# Altium schematic sheet PAGE12.SchDoc
size 246 x 182 mm
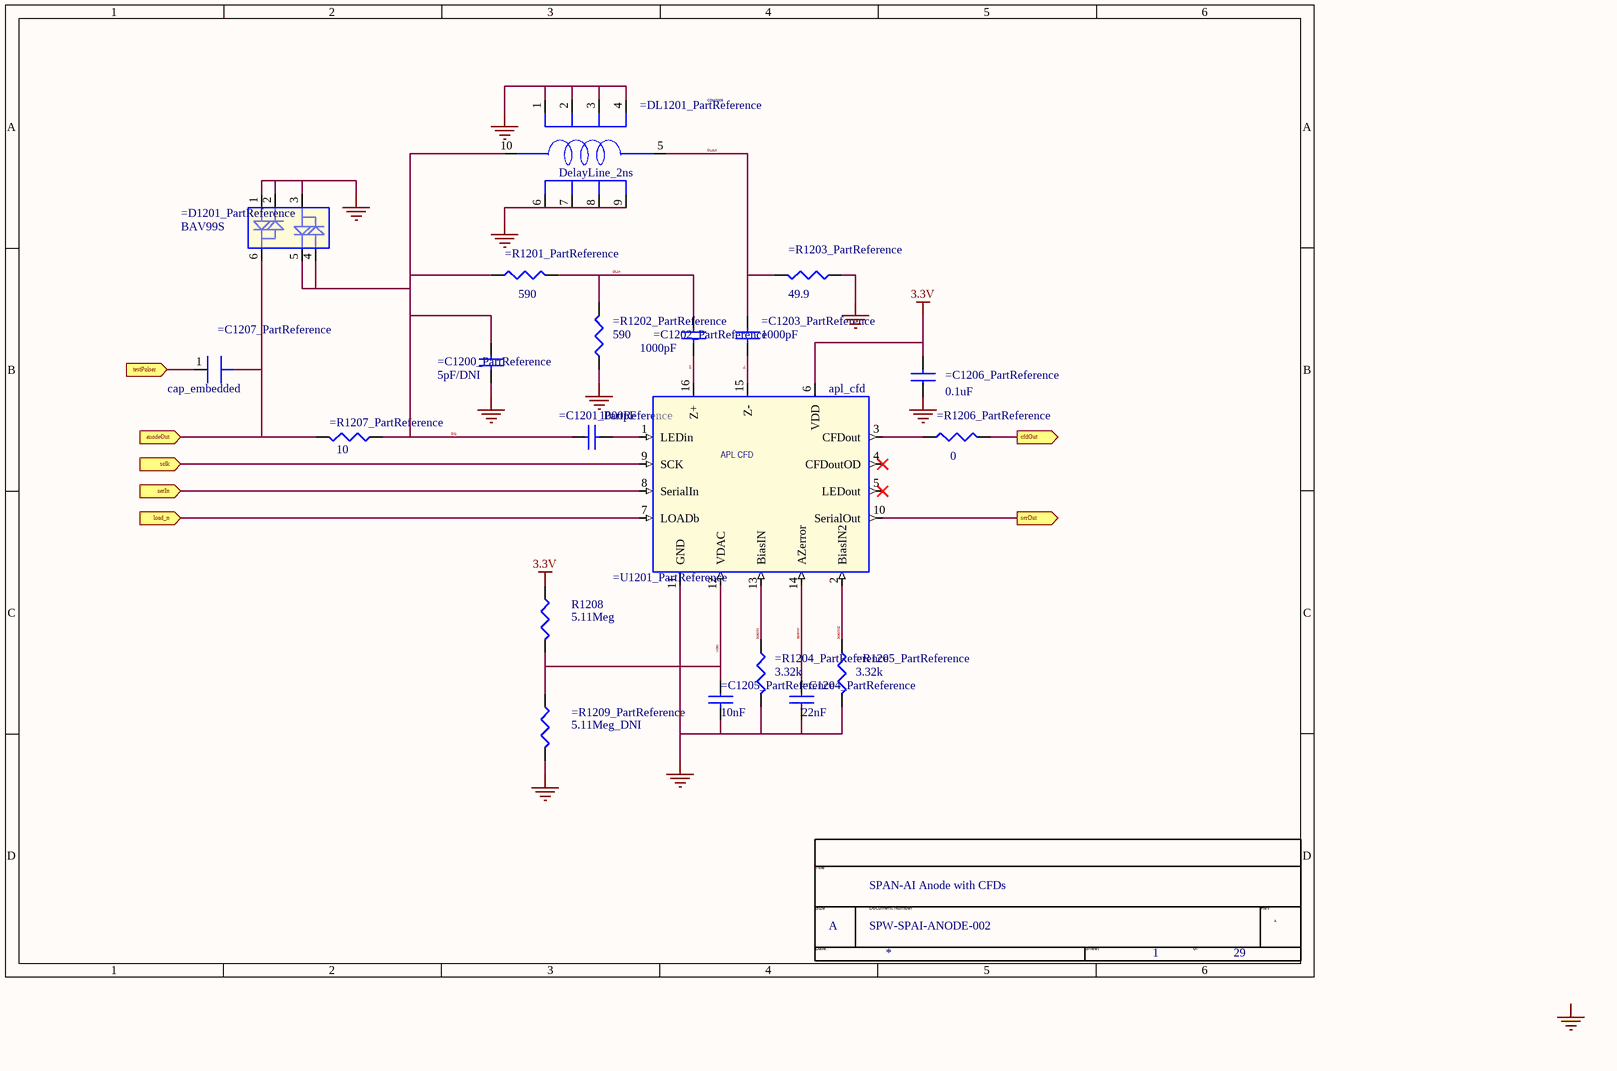
[diagram p0: PAGE12.SchDoc]

## Parts
*  Page Count: 29  Page Number: 1  Page Size: A  Title: SPAN-AI Anode with CFDs  Doc: SPW-SPAI-ANODE-002  (hidden comment: TitleBlock0)  (graphical)
=C1200_PartReference  5pF/DNI  [0402]
=C1201_PartReference  1000pF  [0402]
=C1202_PartReference  1000pF  [0402]
=C1203_PartReference  1000pF  [0402]
=C1204_PartReference  22nF  [0603]
=C1205_PartReference  10nF  [0603]
=C1206_PartReference  0.1uF  [0805]
=C1207_PartReference  cap_embedded  [cap_emb]
=D1201_PartReference  BAV99S  [sot23]
=DL1201_PartReference  DelayLine_2ns  PartNumber: CDM2005  [CDM10]
=R1201_PartReference  590  [0402]
=R1202_PartReference  590  [0402]
=R1203_PartReference  49.9  [0402]
=R1204_PartReference  3.32k  [0402]
=R1205_PartReference  3.32k  [0402]
=R1206_PartReference  0  [0402]
=R1207_PartReference  10  [0402]
=R1209_PartReference  5.11Meg_DNI  [0402]
=U1201_PartReference  apl_cfd  [lcc16]
R1208  5.11Meg  [0402]

## Ports
anodeOut (in), cfdOut (out), load_n (in), sclk (in), serIn (in), serOut (out), testPulser (in)

## Nets
3.3V: =C1206_PartReference.2 =U1201_PartReference.6(VDD) R1208.1
GND: =C1200_PartReference.2 =C1204_PartReference.2 =C1205_PartReference.2 =C1206_PartReference.1 =D1201_PartReference.1 =D1201_PartReference.2 =D1201_PartReference.3 =DL1201_PartReference.1(GND1) =DL1201_PartReference.2(GND2) =DL1201_PartReference.3(GND3) =DL1201_PartReference.4(GND4) =DL1201_PartReference.6(GND5) =DL1201_PartReference.7(GND6) =DL1201_PartReference.8(GND7) =DL1201_PartReference.9(GND8) =R1202_PartReference.1 =R1203_PartReference.1 =R1204_PartReference.2 =R1205_PartReference.2 =R1209_PartReference.2 =U1201_PartReference.11(GND)
anodeOut: =D1201_PartReference.6 =R1207_PartReference.2 ; port anodeOut
azerror: =C1204_PartReference.1 =U1201_PartReference.14(AZerror)
biasIN: =R1204_PartReference.1 =U1201_PartReference.13(BiasIN)
biasIN2: =R1205_PartReference.1 =U1201_PartReference.2(BiasIN2)
cfdOut: =R1206_PartReference.2 ; port cfdOut
DLin: =C1202_PartReference.1 =R1201_PartReference.2 =R1202_PartReference.2
DLout: =C1203_PartReference.1 =DL1201_PartReference.5(OUT) =R1203_PartReference.2
load_n: =U1201_PartReference.7(LOADb) ; port load_n
sclk: =U1201_PartReference.9(SCK) ; port sclk
serIn: =U1201_PartReference.8(SerialIn) ; port serIn
serOut: =U1201_PartReference.10(SerialOut) ; port serOut
Sig: =C1200_PartReference.1 =C1201_PartReference.1 =D1201_PartReference.4 =D1201_PartReference.5 =DL1201_PartReference.10(IN) =R1201_PartReference.1 =R1207_PartReference.1
testPulser: =C1207_PartReference.1 ; port testPulser
vdac: =C1205_PartReference.1 =R1209_PartReference.1 =U1201_PartReference.12(VDAC) R1208.2
z+: =C1202_PartReference.2 =U1201_PartReference.16(Z+)
z-: =C1203_PartReference.2 =U1201_PartReference.15(Z-)
Net=C1201_PartReference_2: =C1201_PartReference.2 =U1201_PartReference.1(LEDin)
Net=R1206_PartReference_1: =R1206_PartReference.1 =U1201_PartReference.3(CFDout)

Not connected (* = marked no-connect by the designer): =U1201_PartReference 4(CFDoutOD)* 5(LEDout)*

## Notes on the sheet
- Labels drawn without touching a wire or pin: GND
- (in symbol apl_cfd_1) APL CFD
- (in symbol TitleBlock0) Title; Size; Document Number; Rev; Date:; Sheet; of

## Library data of the parts
=C1200_PartReference = CAP NP_Dup2: PartNumber: SR0402NPO5R0B3; PCB Footprint: 0402
=C1201_PartReference =C1202_PartReference =C1203_PartReference = CAP NP_Dup2: PartNumber: SR0402NPO102B3; PCB Footprint: 0402
=C1204_PartReference = CAP NP_Dup2: PartNumber: SR0603X7R223K2NT95#M123; PCB Footprint: 0603
=C1205_PartReference = CAP NP_Dup2: PartNumber: SR0603X7R103K2NT95#M123; PCB Footprint: 0603
=C1206_PartReference = CAP NP_Dup2: PartNumber: SR0805X7R104K2NT95#M123; PCB Footprint: 0805
=D1201_PartReference = dual_diode_0: PartNumber: BAV99S; PCB Footprint: BAV99S
=DL1201_PartReference = DelayLine_1: PCB Footprint: CDM2005
=R1201_PartReference =R1202_PartReference = R_Dup1: PartNumber: M55342H11B590DR; PCB Footprint: 0402
=R1203_PartReference = R_Dup1: PartNumber: M55342H11B49D9R; PCB Footprint: 0402
=R1204_PartReference =R1205_PartReference = R_Dup1: PartNumber: M55342H11B3E32R; PCB Footprint: 0402
=R1206_PartReference = R_Dup1: PCB Footprint: 0402
=R1207_PartReference = R_Dup1: PartNumber: M55342H11B10D0R; PCB Footprint: 0402
=R1209_PartReference R1208 = R: Pin Numbers Visible: True; Pin Names Visible: False; EDIForiginalOrigin: (pt 0 0); EDIFviewName: NORMAL; PCB Footprint: 0402
=U1201_PartReference = apl_cfd_1: PCB Footprint: apl_cfd
* = TitleBlock0: RevCode: A; Page Create Date: March  8, 1995; Page Modify Date: *; Page_Number: =TitleBlock_1_Page_Number
=C1207_PartReference = cap_embedded: PCB Footprint: cap_emb